# EAGLE board ThrusterShieldV1.1 (EAGLE 6.6.0)
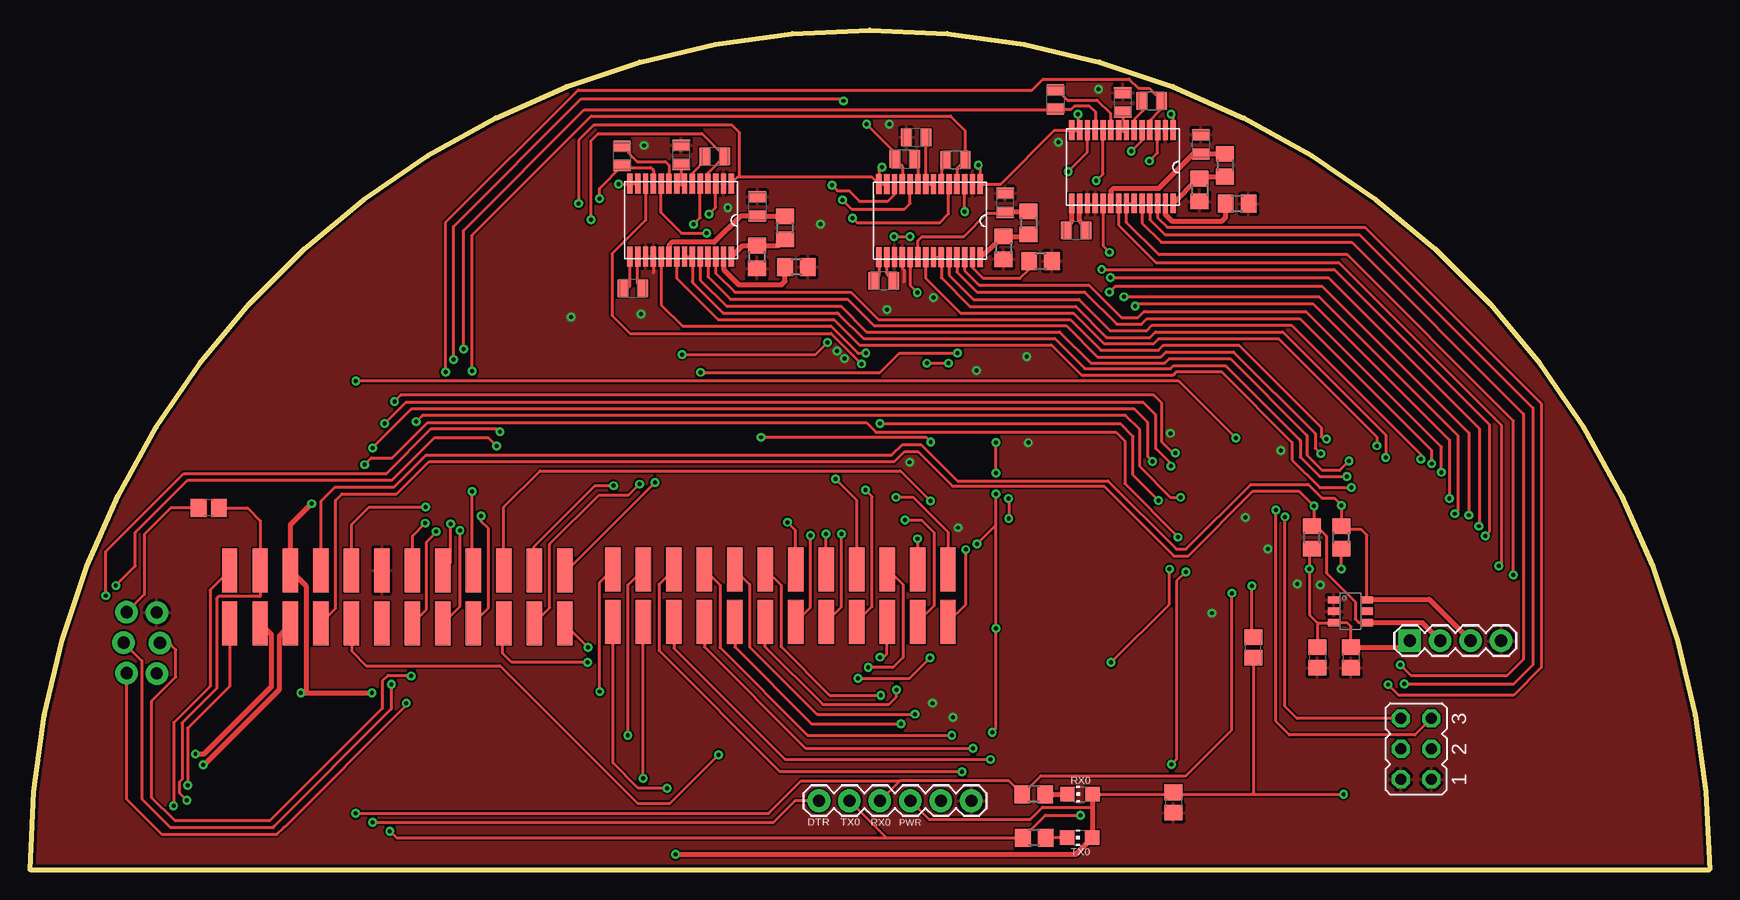
[diagram p5: board, top side]
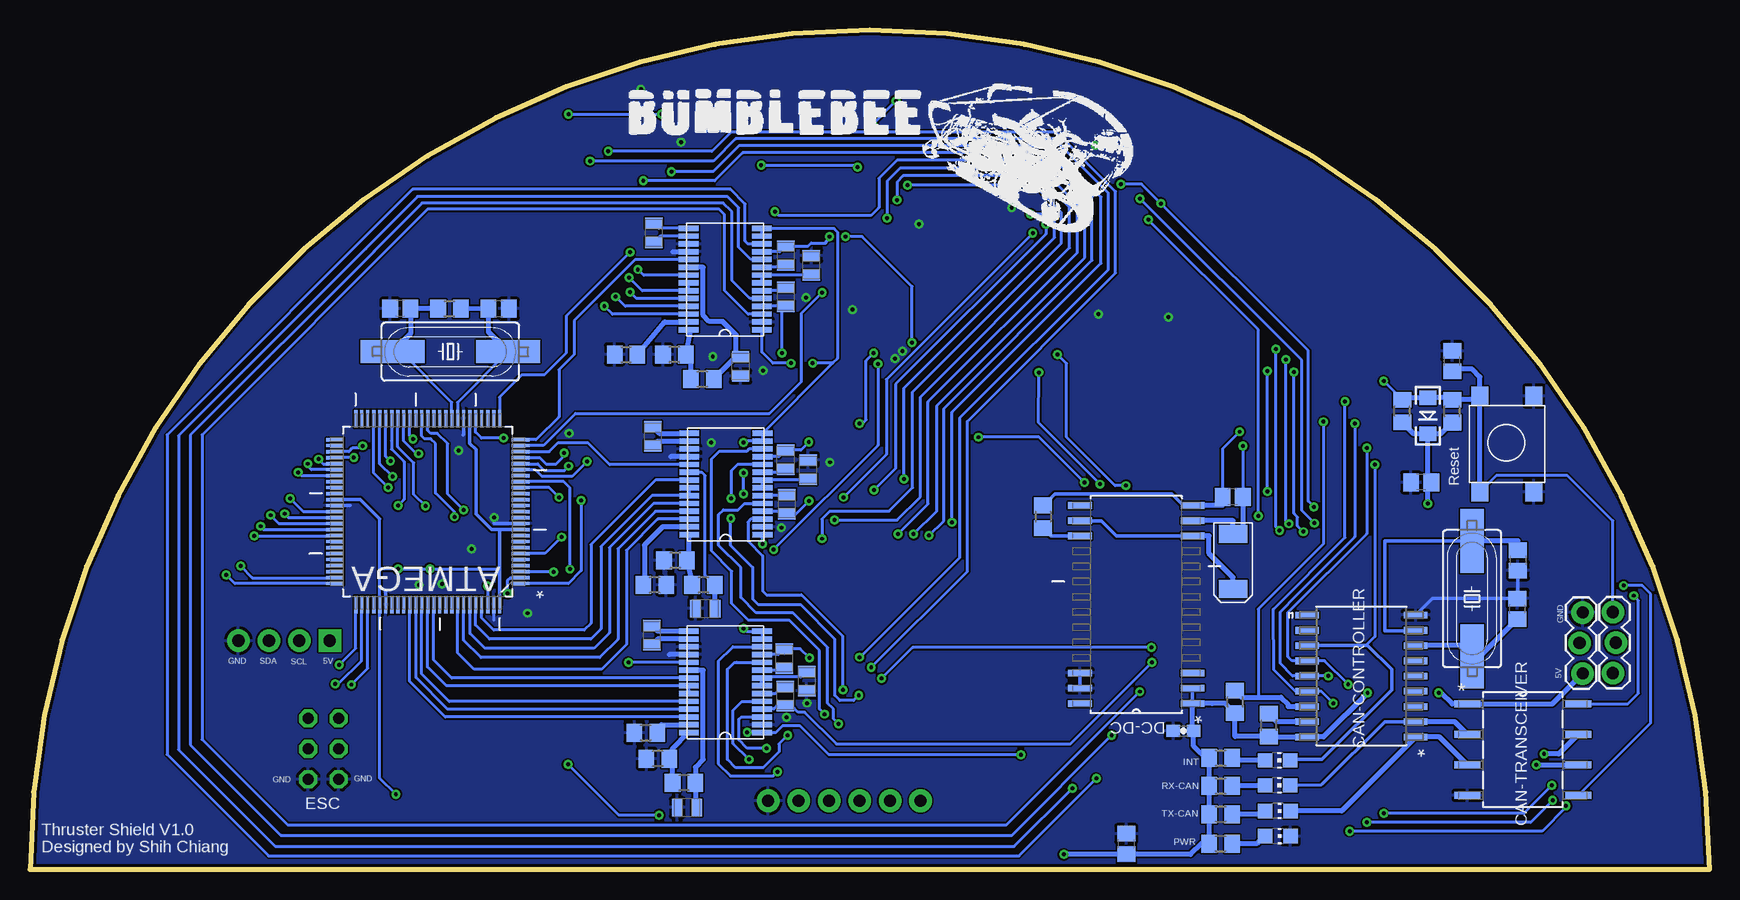
[diagram p6: board, bottom side, seen from below]

Size 140 x 70 mm. Coordinates in mm from the lower left corner, seen from the top.
Outline: 0,0 arc-90 70,70 arc-90 140,0 0,0
Copper layers (1*16): Top 0.035mm / dielectric 1.5mm / Bottom 0.035mm
Design rules "DFRobot_Eagle_Rule_v0.4": minimum track width 6mil, minimum drill 12mil, track to track 6mil, track to pad 6mil, pad to pad 6mil, via to via 6mil, smd to smd 0mil, copper to edge 10mil, drill to drill 10mil, minimum pad ring 12mil, minimum via ring 8mil, stop-mask expansion 2mil, vias tented up to drill 25mil, thermal gap 10mil

## Footprints (pad centres in the part's own frame; a part is rotated, then mirrored left to right if it is on the bottom)
HC49UP = smd 5.334 x 1.93: 1 -4.826,0; 2 4.826,0
QFP50P1600X1600X120-100N = smd 1.473 x 0.279: 1 -7.747,5.994; 2 -7.747,5.512; 3 -7.747,5.004; 4 -7.747,4.496; 5 -7.747,3.988; 6 -7.747,3.505; 7 -7.747,2.997; 8 -7.747,2.489; 9 -7.747,2.007; 10 -7.747,1.499; 11 -7.747,0.991; 12 -7.747,0.508; 13 -7.747,0; 14 -7.747,-0.508; 15 -7.747,-0.991; 16 -7.747,-1.499; 17 -7.747,-2.007; 18 -7.747,-2.489; 19 -7.747,-2.997; 20 -7.747,-3.505; 21 -7.747,-3.988; 22 -7.747,-4.496; 23 -7.747,-5.004; 24 -7.747,-5.512; 25 -7.747,-5.994; 51 7.747,-5.994; 52 7.747,-5.512; 53 7.747,-5.004; 54 7.747,-4.496; 55 7.747,-3.988; 56 7.747,-3.505; 57 7.747,-2.997; 58 7.747,-2.489; 59 7.747,-2.007; 60 7.747,-1.499; 61 7.747,-0.991; 62 7.747,-0.508; 63 7.747,0; 64 7.747,0.508; 65 7.747,0.991; 66 7.747,1.499; 67 7.747,2.007; 68 7.747,2.489; 69 7.747,2.997; 70 7.747,3.505; 71 7.747,3.988; 72 7.747,4.496; 73 7.747,5.004; 74 7.747,5.512; 75 7.747,5.994 | smd 0.279 x 1.473: 26 -5.994,-7.747; 27 -5.512,-7.747; 28 -5.004,-7.747; 29 -4.496,-7.747; 30 -3.988,-7.747; 31 -3.505,-7.747; 32 -2.997,-7.747; 33 -2.489,-7.747; 34 -2.007,-7.747; 35 -1.499,-7.747; 36 -0.991,-7.747; 37 -0.508,-7.747; 38 0,-7.747; 39 0.508,-7.747; 40 0.991,-7.747; 41 1.499,-7.747; 42 2.007,-7.747; 43 2.489,-7.747; 44 2.997,-7.747; 45 3.505,-7.747; 46 3.988,-7.747; 47 4.496,-7.747; 48 5.004,-7.747; 49 5.512,-7.747; 50 5.994,-7.747; 76 5.994,7.747; 77 5.512,7.747; 78 5.004,7.747; 79 4.496,7.747; 80 3.988,7.747; 81 3.505,7.747; 82 2.997,7.747; 83 2.489,7.747; 84 2.007,7.747; 85 1.499,7.747; 86 0.991,7.747; 87 0.508,7.747; 88 0,7.747; 89 -0.508,7.747; 90 -0.991,7.747; 91 -1.499,7.747; 92 -2.007,7.747; 93 -2.489,7.747; 94 -2.997,7.747; 95 -3.505,7.747; 96 -3.988,7.747; 97 -4.496,7.747; 98 -5.004,7.747; 99 -5.512,7.747; 100 -5.994,7.747
CAPC2013X70N = smd 0.914 x 1.448: 1 -0.813,0; 2 0.813,0
C0805 = smd 1.3 x 1.5: 1 -0.85,0; 2 0.85,0
EIA6032 = smd 1.5 x 2.4: P$1 -2.3,0; P$2 2.3,0
0603-CAP = smd 1.1 x 1: 1 -0.85,0; 2 0.85,0
SOIC127P1030X265-18N = smd 1.981 x 0.559: 1 -4.521,5.08; 2 -4.521,3.81; 3 -4.521,2.54; 4 -4.521,1.27; 5 -4.521,0; 6 -4.521,-1.27; 7 -4.521,-2.54; 8 -4.521,-3.81; 9 -4.521,-5.08; 10 4.521,-5.08; 11 4.521,-3.81; 12 4.521,-2.54; 13 4.521,-1.27; 14 4.521,0; 15 4.521,1.27; 16 4.521,2.54; 17 4.521,3.81; 18 4.521,5.08
SOIC254P1040X485-8N = smd 2.159 x 0.61: 1 -4.623,3.81; 2 -4.623,1.27; 3 -4.623,-1.27; 4 -4.623,-3.81; 5 4.623,-3.81; 6 4.623,-1.27; 7 4.623,1.27; 8 4.623,3.81
SOIC127P1032X265-12NA = smd 1.981 x 0.559: 1 -4.699,8.255; 2 -4.699,6.985; 3 -4.699,5.715; 12 -4.699,-5.715; 13 -4.699,-6.985; 14 -4.699,-8.255; 15 4.699,-8.255; 16 4.699,-6.985; 17 4.699,-5.715; 26 4.699,5.715; 27 4.699,6.985; 28 4.699,8.255
CHIP-LED0805 = smd 1.2 x 1.2: A 0,-1.05; C 0,1.05
1X03_LOCK = drill 1.016 pad 1.88: 1 0,0.127; 2 2.54,-0.127; 3 5.08,0.127
JP3Q = drill 0.914 octagon: 1 -2.54,-1.27; 2 -2.54,1.27; 3 0,-1.27; 4 0,1.27; 5 2.54,-1.27; 6 2.54,1.27
1X06 = drill 1.016 pad 1.88: CTS 10.16,0; DTR 0,0; GND 12.7,0; RXI 2.54,0; TXO 5.08,0; VCC 7.62,0
1X04 = drill 1.016 pad 1.88 square: 1 0,0 | drill 1.016 pad 1.88: 2 2.54,0; 3 5.08,0; 4 7.62,0
R0805 = smd 1.3 x 1.5: 1 -0.95,0; 2 0.95,0
LED-1206 = smd 1.2 x 1.4: A -1.5,0; C 1.5,0
15-91-0360 = smd 1.27 x 3.68: 1 -20.32,2.2; 2 -17.78,2.2; 3 -15.24,2.2; 4 -12.7,2.2; 5 -10.16,2.2; 6 -7.62,2.2; 7 -5.08,2.2; 8 -2.54,2.2; 9 0,2.2; 10 2.54,2.2; 11 5.08,2.2; 12 7.62,2.2; 13 -20.32,-2.2; 14 -17.78,-2.2; 15 -15.24,-2.2; 16 -12.7,-2.2; 17 -10.16,-2.2; 18 -7.62,-2.2; 19 -5.08,-2.2; 20 -2.54,-2.2; 21 0,-2.2; 22 2.54,-2.2; 23 5.08,-2.2; 24 7.62,-2.2
SOT23-6 = smd 0.6 x 1.05: 1 -0.95,-1.35; 2 0,-1.35; 3 0.95,-1.35; 4 0.95,1.35; 5 0,1.35; 6 -0.95,1.35
TSSOP-28 = smd 1.65 x 0.45: 1 -3.05,4.195; 2 -3.05,3.545; 3 -3.05,2.895; 4 -3.05,2.245; 5 -3.05,1.595; 6 -3.05,0.945; 7 -3.05,0.295; 8 -3.05,-0.355; 9 -3.05,-1.005; 10 -3.05,-1.655; 11 -3.05,-2.305; 12 -3.05,-2.955; 13 -3.05,-3.605; 14 -3.05,-4.255; 15 3.05,-4.255; 16 3.05,-3.605; 17 3.05,-2.955; 18 3.05,-2.305; 19 3.05,-1.655; 20 3.05,-1.005; 21 3.05,-0.355; 22 3.05,0.295; 23 3.05,0.945; 24 3.05,1.595; 25 3.05,2.245; 26 3.05,2.895; 27 3.05,3.545; 28 3.05,4.195
B3F2-1000 = smd 1.6 x 1.4: 1 8.8,0.7; 2 0.8,0.7; 3 8.8,5.2; 4 0.8,5.2

## Placement (x,y rotation side)
16MHZ  [HC49UP]  19.8,22.58 90 bottom
ATMEGA  ATMEGA2560-16AU  [QFP50P1600X1600X120-100N]  106.85,29.84 180 bottom
C1  470nF  [CAPC2013X70N]  87.22,53.3 180 top
C2  100nF  [CAPC2013X70N]  85.48,64.22 90 top
C3  100nF  [CAPC2013X70N]  93.49,64.07 180 top
C4  4.7uF  [CAPC2013X70N]  91.09,63.94 90 top
C5  100nF  [CAPC2013X70N]  97.61,60.47 270 top
C6  470nF  [CAPC2013X70N]  50.25,48.46 180 top
C7  100nF  [CAPC2013X70N]  49.35,59.48 90 top
C8  100nF  [CAPC2013X70N]  57.09,59.47 180 top
C9  4.7uF  [CAPC2013X70N]  54.29,59.57 90 top
C10  100nF  [CAPC2013X70N]  60.64,55.28 270 top
C11  470nF  [CAPC2013X70N]  71.17,49.09 180 top
C12  100nF  [CAPC2013X70N]  72.91,59.24 0 top
C13  100nF  [CAPC2013X70N]  77.15,59.17 180 top
C14  4.7uF  [CAPC2013X70N]  73.86,61.04 180 top
C15  100nF  [CAPC2013X70N]  81.29,55.58 270 top
C16  470nF  [CAPC2013X70N]  88.01,53.08 90 bottom
C17  100nF  [CAPC2013X70N]  77.01,51.19 270 bottom
C18  100nF  [CAPC2013X70N]  76.99,47.76 90 bottom
C19  4.7uF  [CAPC2013X70N]  75.26,15.72 270 bottom
C20  100nF  [CAPC2013X70N]  80.77,41.94 90 bottom
C21  470nF  [CAPC2013X70N]  88.1,36.11 90 bottom
C22  100nF  [CAPC2013X70N]  77.02,34.16 270 bottom
C23  100nF  [CAPC2013X70N]  76.92,30.45 90 bottom
C24  4.7uF  [CAPC2013X70N]  75.14,33.34 90 bottom
C25  100nF  [CAPC2013X70N]  83.71,21.75 0 bottom
C26  470nF  [CAPC2013X70N]  88.16,19.55 90 bottom
C27  100nF  [CAPC2013X70N]  77.12,17.6 270 bottom
C28  100nF  [CAPC2013X70N]  77.04,14.47 90 bottom
C29  4.7uF  [CAPC2013X70N]  74.87,50.37 90 bottom
C30  100nF  [CAPC2013X70N]  85.23,5.17 0 bottom
C33  0.1uF  [C0805]  107.31,17.68 270 top
C34  10uF  [C0805]  110.11,17.68 270 top
C35  100nF  [C0805]  24.04,32.29 180 bottom
C36  100nF  [C0805]  95.32,5.59 270 top
C37  4.7nF  [C0805]  48.62,2.14 90 bottom
C40  22pF  [C0805]  109.13,46.76 180 bottom
C41  22pF  [C0805]  100.93,46.77 0 bottom
C42  0.1uF  [C0805]  14.92,30.16 180 top
C43  100nF  [C0805]  101.96,18.52 90 top
C44  22pF  [C0805]  21.45,42.39 90 bottom
C53  22pF  [C0805]  16,21.74 90 bottom
C54  22pF  [C0805]  15.97,25.78 270 bottom
C55  100nF  [C0805]  39.74,31.05 180 bottom
C56  1uF  [EIA6032]  39.71,25.68 90 bottom
C57  2.2uF  [0603-CAP]  43.85,11.55 0 bottom
CAN-CONTROLLER  MCP2515-E/SO  [SOIC127P1030X265-18N]  29.02,16.13 180 bottom
CAN-TRANSCEIVER  ISO1050DUBR  [SOIC254P1040X485-8N]  15.56,10 0 bottom
DC-DC  DCR010505U  [SOIC127P1032X265-12NA]  47.79,22.1 180 bottom
INT  [CHIP-LED0805]  36.01,9.1 270 bottom
JP1  [1X03_LOCK]  10.7,21.43 270 bottom
JP2  [1X03_LOCK]  7.93,16.38 90 bottom
JP3  [JP3Q]  115.54,10.06 90 top
JP4  [1X06]  65.77,5.73 0 top
JP5  [1X04]  115.01,19.08 0 top
PWR  [CHIP-LED0805]  35.98,2.78 270 bottom
Q2  [HC49UP]  104.95,43.18 0 bottom
R1  47k  [R0805]  100.63,55.5 180 top
R2  10k  [R0805]  106.86,27.69 90 top
R3  10k  [R0805]  109.3,27.69 90 top
R6  10k  [R0805]  99.62,58.72 270 top
R7  5k  [R0805]  97.49,56.65 270 top
R8  47k  [R0805]  63.89,50.22 180 top
R13  10k  [R0805]  62.92,53.5 270 top
R14  5k  [R0805]  60.59,51.07 270 top
R15  47k  [R0805]  84.24,50.71 180 top
R20  10k  [R0805]  83.25,53.91 270 top
R21  5k  [R0805]  81.14,51.83 270 top
R22  47k  [R0805]  90.31,42.94 0 bottom
R27  10k  [R0805]  83.96,40.88 180 bottom
R28  5k  [R0805]  86.28,42.93 180 bottom
R29  47k  [R0805]  87.92,23.73 180 bottom
R34  10k  [R0805]  83.86,23.73 180 bottom
R35  5k  [R0805]  86.2,25.77 180 bottom
R36  47k  [R0805]  88.67,11.41 0 bottom
R41  10k  [R0805]  85.48,7.22 180 bottom
R42  5k  [R0805]  87.67,9.24 180 bottom
R53  10k  [R0805]  25.62,38.23 90 bottom
R58  1M  [R0805]  105.03,46.77 0 bottom
R62  10k  [R0805]  21.45,38.22 90 bottom
R69  330  [R0805]  83.67,6.29 180 top
R70  330  [R0805]  83.72,2.66 180 top
R74  330  [R0805]  40.76,2.16 0 bottom
R75  330  [R0805]  40.76,4.62 0 bottom
R76  330  [R0805]  40.76,6.98 0 bottom
R77  330  [R0805]  40.76,9.32 0 bottom
R78  10k  [R0805]  36.73,12.04 90 bottom
R79  10k  [R0805]  55.54,29.41 270 bottom
R82  10k  [R0805]  39.55,13.98 90 bottom
RX0  [CHIP-LED0805]  87.53,6.29 90 top
RX-CAN  [CHIP-LED0805]  36.01,7.02 270 bottom
SWITCHING-CHIP-DIODE  [LED-1206]  23.49,37.84 270 bottom
TX0  [CHIP-LED0805]  87.5,2.66 90 top
TX-CAN  [CHIP-LED0805]  35.98,4.89 270 bottom
U$1  15-91-0360  [15-91-0360]  36.96,22.73 0 top
U$2  15-91-0360  [15-91-0360]  68.91,22.83 0 top
U$4  AD7414  [SOT23-6]  110.06,21.54 270 top
U$25  A3941KLPTR-T  [TSSOP-28]  91.1,58.59 270 top
U$26  A3941KLPTR-T  [TSSOP-28]  54.27,54.15 270 top
U$27  A3941KLPTR-T  [TSSOP-28]  75.02,54.11 270 top
U$28  A3941KLPTR-T  [TSSOP-28]  82.06,49.2 180 bottom
U$29  A3941KLPTR-T  [TSSOP-28]  81.99,32.12 180 bottom
U$30  A3941KLPTR-T  [TSSOP-28]  82.04,15.61 180 bottom
U$35  B3FS-1000  [B3F2-1000]  13.94,30.68 90 bottom

## Tracks (layer width: path | path; a pad name or v marks a point on that pad's centre or on a via)
+5V  (via drill 0.33)
  Top 0.254: RX0.A 95.4,6.29 102.06,6.29 | 102.06,6.29 109.48,6.29 v109.5,6.27 | JP4.VCC 74.93,4.19 83.39,4.19 84.4,5.21 88.55,5.21 | C43.1 101.96,6.39 102.06,6.29 | R2.1 106.66,26.53 v106.66,25.07 106.66,21.23 107.31,20.57 | v109.32,25.07 109.3,25.1 R3.1 | 107.31,20.57 108.69,20.57 U$4.3 108.75,20.55 109.83,20.55 110.11,20.27 C34.1 | 107.31,20.57 C33.1
  Top 0.406: v22.58,14.73 23.09,14.73 | 23.09,14.73 v28.5,14.73 | v53.82,1.27 87.17,1.27 TX0.A 88.55,5.21 88.55,6.26 RX0.A | 23.09,14.73 23.02,14.81 23.02,23.64 U$1.3 21.72,28.75 v23.47,30.51 | C36.1 95.4,6.44 95.4,6.29 | C34.1 114.46,18.53 JP5.1
  Bottom 0.254: ATMEGA.80 110.83,7.61 v109.5,6.27 | 100.85,25.07 v106.66,25.07 v109.32,25.07 110.74,25.07 arc-90 110.87,24.94 | 110.87,22.1 110.87,24.94 | 110.87,24.94 110.87,29.24
  Bottom 0.305: DC-DC.2 DC-DC.1 | ATMEGA.100 100.85,25.07 100.85,28.34 ATMEGA.10 101.51,28.34 102.82,29.65 102.82,35 103.34,35.52 ATMEGA.31 | ATMEGA.80 110.87,22.1 | ATMEGA.61 112.46,30.83 110.87,29.24
  Bottom 0.406: 41.48,13.85 40.36,13.85 R82.1 39.55,11.09 R78.1 36.69,11.05 CAN-CONTROLLER.18 32.18,11.05 v28.5,14.73 | 41.48,13.85 DC-DC.1 43.09,11.64 C57.2 43.01,10.29 41.83,9.12 R77.1 R76.1 R75.1 R74.1 42.37,2.16 43.25,1.27 49.3,1.27 | 41.45,13.87 41.48,13.85 | JP1.3 13.12,13.81 CAN-TRANSCEIVER.1 21.45,13.81 22.38,14.73 v22.58,14.73 | 49.3,1.27 v53.82,1.27 | R53.1 24.68,36.34 SWITCHING-CHIP-DIODE.C | SWITCHING-CHIP-DIODE.C 22.38,36.34 R62.1 | v23.47,30.51 23.47,32.41 | 23.47,32.41 23.47,36.32 SWITCHING-CHIP-DIODE.C | C37.1 49.3,1.29 49.3,1.27 | C35.1 23.47,32.41
BATT1  (via drill 0.33)
  Top 0.254: U$27.14 U$27.13 | U$25.14 85.41,61.64 80.93,57.16 U$27.1 79.21,58.56 v79.05,58.72 | U$25.1 95.29,62.8 v95.12,62.97 | v87.35,62.97 87.35,61.78 U$25.13 | v71.02,58.57 70.76,58.31 U$27.14 | U$27.14 70.16,57.76 59.02,57.76 U$26.1 59.16,57.89 59.16,61.42 58.52,62.05 46.99,62.05 45.73,60.8 v45.73,55.54 | 50.49,57.37 U$26.13 U$26.14 49.97,57.15 v49.07,57.15 | v32.97,30.23 28.27,30.23 26.8,28.75 U$1.5
  Top 0.406: U$25.13 U$25.14
  Bottom 0.254: v95.12,62.97 v87.35,62.97 | v79.05,58.72 71.17,58.72 v71.02,58.57 | v32.97,30.23 33.45,30.71 33.45,43.26 v45.73,55.54 47.35,57.15 v49.07,57.15
BATT2  (via drill 0.33)
  Top 0.254: v74.75,42.21 v76.56,42.21 | 80.52,28.73 v78.94,27.15 | 80.52,28.73 v80.52,20.12 80.52,11.73 v80.21,11.43 | U$1.17 26.8,18.24 28.04,16.99 39.17,16.99 50.65,5.51 53.34,5.51 v57.4,9.58 | 80.52,28.73 v80.52,31.32 | v80.52,33.07 v80.52,35.61
  Bottom 0.254: U$28.13 U$28.14 78.99,53.44 72.97,53.44 72.69,53.16 72.69,42.62 73.1,42.21 | U$30.13 U$30.14 80.27,19.87 v80.52,20.12 | 73.1,42.21 U$29.14 U$29.13 80.41,35.72 v80.52,35.61 | v76.56,42.21 78.08,42.21 78.99,43.13 78.99,45 U$28.1 | 73.1,42.21 v74.75,42.21 | v78.94,27.15 U$29.1 | v80.21,11.43 79,11.43 U$30.1 78.97,11.4 77.85,11.4 77.27,11.99 75.82,11.99 73.41,9.58 v57.4,9.58 | v80.52,31.32 v80.52,33.07
CANH  (via drill 0.33)
  Top 0.406: U$1.14 20.12,19.59 20.12,15.24 14.5,9.63 v13.79,9.63
  Bottom 0.406: CAN-TRANSCEIVER.7 12.58,9.63 v13.79,9.63
CANL  (via drill 0.33)
  Top 0.406: U$1.15 20.78,19.49 20.78,14.99 14.53,8.74 v14.43,8.74
  Bottom 0.406: v14.43,8.74 10.95,8.74 CAN-TRANSCEIVER.6
D8  (via drill 0.33)
  Top 0.254: v95.91,31.04 95.07,31.04 92.51,33.6 92.51,36.68 91.31,37.87 32.72,37.87 v32.18,37.34
  Bottom 0.254: v32.18,37.34 32.18,27.15 37.62,21.72 37.62,14.37 | v95.91,31.04 96.72,31.85 ATMEGA.17
  Bottom 0.406: R82.2 38.99,14.37 37.62,14.37 35.72,14.37 35.12,13.76 35.12,13.6 35.11,13.59 CAN-CONTROLLER.16
D45  (via drill 0.33)
  Top 0.254: JP3.6 105.61,12.6 104.62,13.59 v104.62,29.41
  Bottom 0.254: ATMEGA.39 107.36,36.16 107.11,35.92 106.6,35.92 106.2,35.51 106.2,31.39 104.62,29.82 v104.62,29.41
D46  (via drill 0.33)
  Top 0.254: JP3.5 115.44,11.23 104.98,11.23 103.86,12.34 v103.86,29.97
  Bottom 0.254: ATMEGA.38 106.85,36.62 106.6,36.37 106.05,36.37 105.18,35.51 105.18,31.29 v103.86,29.97
D50  (via drill 0.33)
  Top 0.254: v31.37,13.87 31.37,13.69 21.21,3.53 21.18,3.53 20.57,2.92 11,2.92 8.06,5.86 JP2.1 | v95.48,34.72 95.28,34.72 94.34,35.66 94.34,38.89 93.67,39.55 30.91,39.55 v30.38,39.01
  Bottom 0.254: v31.37,13.87 32.36,14.86 CAN-CONTROLLER.15 34.52,14.86 36.32,16.66 36.37,21.69 30.38,27.69 v30.38,39.01 | ATMEGA.22 97.51,34.34 96.98,33.81 96.16,33.81 95.48,34.49 v95.48,34.72
D51  (via drill 0.33)
  Top 0.254: v95.1,33.63 95.1,33.86 93.85,35.1 93.85,37.9 92.81,38.94 31.32,38.94 v29.57,37.19 | JP1.2 11.59,18.89 12.17,18.31 12.17,16.05 10.16,14.05 10.16,5.99 12.06,4.09 20.02,4.09 29.36,13.44 29.36,15.72 29.84,16.21 31.7,16.21 v31.77,16.13
  Bottom 0.254: v31.78,16.13 v31.77,16.13 CAN-CONTROLLER.14 34.75,16.13 35.76,17.17 35.76,21.49 34.39,22.91 29.57,27.74 v29.57,37.19 | ATMEGA.21 97.69,33.83 97.13,33.27 95.45,33.27 v95.1,33.63
D52  (via drill 0.33)
  Top 0.254: JP2.2 9.32,17.4 9.32,5.89 11.68,3.53 20.34,3.53 20.34,3.61 30.12,13.39 v30.12,15.44 | v93.57,34.01 93.17,34.42 93.17,37.29 92.08,38.38 31.77,38.38 28.57,35.18 v28.57,35.15
  Bottom 0.254: v30.12,15.44 32.08,17.4 CAN-CONTROLLER.13 34.8,17.4 35.13,17.73 35.13,21.44 28.57,27.99 v28.57,35.15 | ATMEGA.20 97.89,33.35 97.33,32.79 94.79,32.79 v93.57,34.01
DTR  (via drill 0.33)
  Top 0.254: C42.1 18.13,30.16 19.2,29.08 19.2,24.96 U$1.2 19.18,22.76 15.72,22.76 15.54,22.58 15.54,15.09 12.68,12.22 12.68,7.52 12.45,7.29 12.45,6.4 v13.08,5.77 | JP4.DTR 63.77,5.73 61.98,3.94 v28.55,3.94
  Bottom 0.254: v13.08,5.77 14.91,3.94 v28.55,3.94
FF1A  (via drill 0.33)
  Top 0.254: U$25.25 93.34,54.21 94.61,52.93 110.82,52.93 125.27,38.48 125.27,17.07 123.67,15.47 v114.55,15.47
  Bottom 0.254: ATMEGA.77 112.36,17.41 114.3,15.47 v114.55,15.47
FF1B  (via drill 0.33)
  Top 0.254: U$26.25 56.51,49.43 58.4,47.55 68.15,47.55 70.36,45.34 86.39,45.34 88.98,42.75 94.28,42.75 94.69,43.15 100.33,43.15 107.14,36.35 107.14,35.13 v107.59,34.67
  Bottom 0.254: v107.59,34.67 107.8,34.67 108.85,35.73 ATMEGA.42
FF1C  (via drill 0.33)
  Top 0.254: U$27.25 77.26,49.82 78.92,48.16 87.91,48.16 90.6,45.47 92.66,45.47 93.12,45.92 105.84,45.92 116.84,34.93 v116.84,33.83
  Bottom 0.254: ATMEGA.56 116.56,33.35 116.84,33.63 v116.84,33.83
FF1D  (via drill 0.33)
  Top 0.254: v91.19,47.75 107.44,47.75 119.02,36.17 119.02,29.92 v118.77,29.67
  Bottom 0.254: U$28.25 90.39,46.96 v91.19,47.75 | v118.77,29.67 118.44,29.34 ATMEGA.64
FF1E
  Bottom 0.254: U$29.25 87.86,29.87 90.98,26.75 90.98,19.2 92.51,17.68 102.41,17.68 103.85,19.12 ATMEGA.94
FF1F
  Bottom 0.254: U$30.25 105.19,13.37 107.82,16 107.82,22.08 ATMEGA.86
FF2A  (via drill 0.33)
  Top 0.254: U$25.26 93.99,54.34 94.79,53.54 111.28,53.54 125.98,38.84 125.98,16.84 123.67,14.53 114.1,14.53 v113.21,15.42
  Bottom 0.254: ATMEGA.78 111.84,22.08 111.84,16.79 v113.21,15.42
FF2B  (via drill 0.33)
  Top 0.254: U$26.26 57.16,49.72 58.75,48.13 68.45,48.13 70.74,45.85 86.72,45.85 89.26,43.31 94.08,43.31 94.49,43.71 100.79,43.71 107.64,36.86 107.64,36.07 107.82,35.89 v108.08,35.89
  Bottom 0.254: ATMEGA.41 108.34,36.16 v108.08,35.89
FF2C  (via drill 0.33)
  Top 0.254: U$27.26 77.91,49.95 79.12,48.74 88.27,48.74 90.98,46.02 92.35,46.02 92.86,46.53 106.35,46.53 117.65,35.23 v117.65,33.12
  Bottom 0.254: ATMEGA.57 117.37,32.84 v117.65,33.12
FF2D  (via drill 0.33)
  Top 0.254: v92.13,46.99 92.3,47.17 106.93,47.17 118.31,35.81 v118.31,30.94
  Bottom 0.254: U$28.26 91.44,46.31 v92.13,46.99 | ATMEGA.63 117.22,29.84 v118.31,30.94
FF2E
  Bottom 0.254: U$29.26 87.67,29.22 90.27,26.62 90.27,18.77 92.35,16.69 102.98,16.69 104.36,18.07 104.36,18.71 ATMEGA.93
FF2F
  Bottom 0.254: U$30.26 105.38,12.72 108.36,15.7 ATMEGA.85
GHA1  (via drill 0.33)
  Top 0.254: U$2.19 65.05,21.85 v65.05,27.86 | U$25.10 89.44,58 v88.88,57.43
  Bottom 0.254: v88.88,57.43 82.93,57.43 80.59,59.77 55.14,59.77 51.46,56.08 51.46,50.8 63.83,38.43 63.83,29.08 v65.05,27.86
GHA2  (via drill 0.33)
  Top 0.254: U$2.12 76.56,25.06 76.56,28.12 73.64,31.04 v72.19,31.04 | U$26.10 52.61,54.75 54.3,53.06 v56.41,53.06
  Bottom 0.254: v56.41,53.06 68.61,40.87 68.61,34.62 v72.19,31.04
GHA3  (via drill 0.33)
  Top 0.254: v67.72,55.83 68.48,55.07 72.9,55.07 73.36,55.53 U$27.10 | v72.92,29.13 74.32,29.13 75.34,28.12 75.34,21.98 U$2.23
  Bottom 0.254: v72.92,29.13 67.72,29.13 65.79,31.06 65.79,39.4 53.34,51.84 53.34,55.22 55.96,57.84 67.21,57.84 67.72,57.33 v67.72,55.83
GHA4  (via drill 0.33)
  Top 0.254: v53.11,6.78 50.7,6.78 48.59,8.89 U$2.13
  Bottom 0.254: U$28.10 79.89,50.86 80.92,51.89 80.92,55.17 81.86,56.11 107.7,56.11 112.01,51.79 112.01,51.77 127.61,36.17 127.61,9.98 119.56,1.93 57.96,1.93 v53.11,6.78
GHA5  (via drill 0.33)
  Top 0.254: U$2.6 62.59,23.74 62.59,18.59 66.65,14.53 v70.92,14.53 | v81.56,30.94 81.58,30.91 v81.58,29.26
  Bottom 0.254: U$29.10 81.04,33.77 81.56,33.25 v81.56,30.94 | v70.92,14.53 71.35,14.1 72.49,14.1 72.9,14.5 72.9,19.2 75.77,22.1 79.3,22.1 79.76,22.56 79.76,25.2 81.58,27.03 v81.58,29.26 81.56,29.29
GHA6  (via drill 0.33)
  Top 0.254: U$2.4 57.51,23.74 57.51,18.52 64.82,11.2 v76.83,11.2
  Bottom 0.254: v76.83,11.2 77.57,10.46 77.57,9.8 78.89,8.48 81.18,8.48 81.86,9.17 81.86,16.69 81.28,17.27 81.1,17.27 | 81.1,17.27 | 81.1,17.27 U$30.10
GHB1  (via drill 0.33)
  Top 0.254: U$2.10 71.48,25.06 72.77,23.76 72.77,17.68 71.93,16.84 v69.88,16.84 | v91.8,59.89 92.69,60.79 U$25.5
  Bottom 0.254: v91.8,59.89 83.16,59.89 81.56,61.49 54.46,61.49 49.51,56.54 49.51,49.73 61.87,37.36 61.87,24.84 v69.88,16.84
GHB2  (via drill 0.33)
  Top 0.254: U$2.21 70.21,21.93 70.21,31.09 v69.65,31.65 | v55.32,53.8 55.86,54.34 U$26.5
  Bottom 0.254: v55.32,53.8 55.32,52.98 67.84,40.46 67.84,33.45 v69.65,31.65
GHB3  (via drill 0.33)
  Top 0.254: U$2.20 67.64,21.9 v67.64,27.97 | U$27.5 76.58,57.13 76.58,54.69 75.79,53.9 68.96,53.9 v68.56,54.31
  Bottom 0.254: v67.64,27.97 65.13,30.48 65.13,39.01 52.7,51.44 52.7,55.42 55.78,58.5 67.46,58.5 68.56,57.4 v68.56,54.31
GHB4  (via drill 0.33)
  Top 0.254: U$2.2 49.84,23.74 v49.84,11.18
  Bottom 0.254: U$28.5 79.97,47.61 81.48,49.12 81.48,54.84 82.22,55.58 107.31,55.58 111.33,51.56 111.33,51.54 126.64,36.22 126.64,10.41 119.1,2.87 58.14,2.87 v49.84,11.18
GHB5  (via drill 0.33)
  Top 0.254: U$2.17 58.75,18.54 65.15,12.14 v72.59,12.14
  Bottom 0.254: 78.96,30.51 U$29.5 80.45,30.52 80.97,30 82.19,30 82.6,29.59 82.6,27.03 80.75,25.17 80.75,22.68 79.48,21.41 76.4,21.41 73.51,18.52 73.51,13.87 73.03,13.39 73.03,12.57 v72.59,12.14
GHB6  (via drill 0.33)
  Top 0.254: U$2.15 53.67,18.44 62.94,9.17 v80.06,9.17
  Bottom 0.254: v80.06,9.17 81.38,10.49 81.38,13.28 80.65,14.02 U$30.5
GLA1  (via drill 0.33)
  Top 0.254: U$25.12 88.14,59.8 v86.54,58.19 | U$2.7 63.83,28.27 v63.14,28.96
  Bottom 0.254: v63.14,28.96 63.14,38.13 50.72,50.55 50.72,56.08 54.99,60.35 80.9,60.35 83.06,58.19 v86.54,58.19
GLA2  (via drill 0.33)
  Top 0.254: U$2.24 78,22.11 v78,26.67 | U$26.12 51.31,54.13 48.51,51.33 48.51,46.2 50.01,44.7 66.78,44.7 v69.32,42.16 69.06,42.16
  Bottom 0.254: v69.32,42.16 69.32,35.36 v78,26.67
GLA3  (via drill 0.33)
  Top 0.254: v66.85,57.05 67.31,56.59 68.28,56.59 69.14,55.73 71.5,55.73 72.06,56.29 U$27.12 | 74.02,25.06 U$2.11 v73.99,27.58
  Bottom 0.254: v66.85,57.05 56.29,57.05 54.03,54.79 54.03,52.22 66.42,39.83 66.42,31.85 68.38,29.9 73.3,29.9 73.99,29.21 v73.99,27.58
GLA4  (via drill 0.33)
  Top 0.254: v51.1,7.59 51.1,20.61 U$2.14
  Bottom 0.254: U$28.12 80.15,52.16 80.39,52.4 80.39,55.5 81.61,56.72 108.1,56.72 128.57,36.25 128.57,9.6 120.12,1.14 57.56,1.14 v51.1,7.59
GLA5  (via drill 0.33)
  Top 0.254: U$2.5 59.99,23.79 59.99,18.54 65.61,12.93 65.63,12.95 v73.76,12.95
  Bottom 0.254: v73.76,12.95 74.19,13.39 74.19,18.26 76.71,20.78 80.11,20.78 81.51,22.17 81.51,24.87 83.19,26.54 83.19,34.24 82.55,34.87 80.24,34.87 80.04,35.07 U$29.12
GLA6  (via drill 0.33)
  Top 0.254: U$2.3 52.43,23.79 52.43,18.26 62.53,8.15 v77.7,8.15
  Bottom 0.254: U$30.12 81.41,18.57 82.63,17.35 82.63,8.81 81.61,7.8 78.05,7.8 v77.7,8.15
GLB1  (via drill 0.33)
  Top 0.254: U$2.22 71.4,20.58 71.4,17.96 71.14,17.7 v70.84,17.7 | U$25.3 93.99,59.75 v93.32,59.08
  Bottom 0.254: v93.32,59.08 83.03,59.08 81.18,60.93 54.63,60.93 50.11,56.41 50.11,50.04 62.48,37.67 62.48,26.04 70.81,17.7 v70.84,17.7
GLB2  (via drill 0.33)
  Top 0.254: U$2.9 68.94,25.06 68.94,30.78 v67.16,32.56 | v56.59,54.64 57.16,55.21 U$26.3
  Bottom 0.254: v67.16,32.56 67.16,40.13 54.59,52.71 54.59,54.23 54.99,54.64 v56.59,54.64
GLB3  (via drill 0.33)
  Top 0.254: U$2.8 66.34,25.06 v66.34,27.97 | v77.91,54.85 U$27.3
  Bottom 0.254: v66.34,27.97 64.41,29.9 64.41,38.68 52.07,51.03 52.07,55.78 55.42,59.13 67.74,59.13 69.24,57.63 69.24,55.19 69.9,54.53 77.6,54.53 v77.91,54.85
GLB4  (via drill 0.33)
  Top 0.254: v47.5,14.83 47.5,23.94 U$2.1
  Bottom 0.254: U$28.3 80.14,46.31 82.12,48.29 82.12,54.61 82.55,55.04 106.86,55.04 125.65,36.25 125.65,10.85 118.52,3.71 58.62,3.71 v47.5,14.83
GLB5  (via drill 0.33)
  Top 0.254: U$2.18 61.29,18.57 66.09,13.77 71.6,13.77 72.24,14.4 v72.24,14.99
  Bottom 0.254: U$29.3 79.9,29.22 80.16,28.96 80.16,27.41 78.92,26.16 78.92,23.22 78.61,22.91 75.69,22.91 72.24,19.46 v72.24,14.99
GLB6  (via drill 0.33)
  Top 0.254: U$2.16 56.21,18.54 64.64,10.11 v78.61,10.11
  Bottom 0.254: v78.61,10.11 80.21,10.11 80.9,10.8 80.9,12.52 80.7,12.73 U$30.3
GND  (via drill 0.33)
  Top 0.254: U$27.18 72.71,50.15 72.87,49.99 72.87,49.02 72.85,49 | U$26.18 51.96,49.75 51.94,49.73
  Bottom 0.254: ATMEGA.32 | ATMEGA.99 101.35,22.08 101.35,20.8
  Bottom 0.305: DC-DC.26 DC-DC.27 | CAN-CONTROLLER.9 23.12,22.59 C53.2 15.97,22.62 C54.2 | ATMEGA.11 99.11,28.84 101.32,28.84 v101.32,29.35 | ATMEGA.81 110.36,23.23 | ATMEGA.62 113.31,30.35 | ATMEGA.32 103.85,36.27 103.88,36.24
  Bottom 0.406: U$28.18 85.12,51.49 86.41,51.49 | U$29.18 86.59,34.42 | U$30.18 86.69,17.92
  other vias: 103.2,26.74 104.26,34.94 107.56,23.74 51.18,60.38 71.63,62.15 89.08,65.05 78.89,41.61 83.08,42.77 73.33,33.96 75.23,13.87 76.94,12.67 83.21,35.59 77.37,28.5 50.93,46.3 71.45,46.69 85.72,60.66 75.31,47.7 98.52,21.38 105.66,23.81 95.07,36.37 65.89,53.82 58.17,55.19 45.11,46.05 67.26,43.23 67.89,42.6
  pour Bottom: 0,0 140,0 140,70 0,70
  pour Top: 0,0 140,0 140,70 0,70
GNDBUS  (via drill 0.33)
  Top 0.254: v7.16,23.67 8.79,25.3 8.79,28.09 13.16,32.46 30.18,32.46 33.73,36.02 38.18,36.02 v38.89,35.31
  Bottom 0.254: CAN-TRANSCEIVER.5 4.9,12.23 4.9,22.96 5.61,23.67 v7.16,23.67 | 38.58,31.37 C55.1 v38.89,35.31
  Bottom 0.406: C55.1 38.9,27.98 C56.P$2 39.72,29.09 DC-DC.13
INT  (via drill 0.33)
  Top 0.254: v27.89,33.76 28.45,34.32 30.2,34.32 33.15,37.26 69.72,37.26 70.51,36.47 90.5,36.47 91.26,35.71 91.26,32.18 v95.68,27.71
  Bottom 0.254: CAN-CONTROLLER.12 28.65,18.67 27.89,19.43 v27.89,33.76 | INT.C 34.88,9.19 | ATMEGA.6 99.07,26.37 97.08,26.37 v95.68,27.71
  Bottom 0.305: CAN-CONTROLLER.12 33.51,18.7 28.5,18.7 26.49,16.69 26.49,14.99 32.3,9.19 34.88,9.19
N$1
  Top 0.406: U$25.27 94.64,54.61 95.17,54.08 99.36,54.08 99.67,54.38 99.67,55.49 R1.2
N$3
  Top 0.406: C1.1 87.49,54.15 U$25.16
N$4
  Top 0.406: C1.2 86.84,54.06 U$25.15
N$5
  Top 0.254: C3.2 92.72,63.21 92.08,62.56 92.08,61.67 U$25.6
N$6
  Top 0.254: C2.2 85.59,65.03 86.46,64.16 88.95,64.16 90.07,63.04 90.07,61.66 U$25.9
N$10
  Top 0.254: C4.1 91.14,61.89 U$25.7
  Top 0.406: U$25.8 U$25.7
N$11
  Top 0.406: U$25.20 90.1,56.59 90.29,56.78 94.06,56.78 96.94,59.66 C5.2 R6.1
N$12
  Top 0.406: R6.2 97.66,57.77 R7.1 97.36,57.6 U$25.28
N$13
  Top 0.406: U$26.27 57.81,50.03 59.08,48.77 62.66,48.77 62.94,49.05 R8.2
N$14
  Top 0.254: C8.2 56.28,59.13 55.21,58.06 U$26.6
N$15
  Top 0.254: C7.2 50.62,59.03 52.96,59.03 53.26,58.72 U$26.9
N$16
  Top 0.254: C9.1 54.29,57.57 U$26.8
  Top 0.406: U$26.8 U$26.7
N$21
  Top 0.254: C6.1 50.66,48.86 U$26.16
N$22
  Top 0.254: 49.59,48.22 50.01,48.64 U$26.15
  Top 0.406: 49.59,48.22 C6.2
N$23
  Top 0.406: U$26.20 53.27,51.11 53.27,52.07 53.49,52.29 57.04,52.29 59.22,54.47 C10.2 62.9,54.47 R13.1
N$24
  Top 0.406: U$26.28 59.38,52.02 R14.1 62.39,52.02 R13.2
N$25
  Top 0.254: U$27.27 78.56,50.19 79.45,49.3 82.53,49.3 83.26,50.04 83.26,50.69
  Top 0.406: 83.26,50.69 R15.2
N$26
  Top 0.254: C13.2 75.96,58.8 U$27.6
N$27
  Top 0.254: C12.2 74.01,58.95 U$27.9
N$28
  Top 0.254: C14.1 74.66,61.03 U$27.8 U$27.7
N$33
  Top 0.254: U$27.16 71.41,49.66 C11.1
N$34
  Top 0.254: U$27.15 70.76,49.5 C11.2
N$35
  Top 0.254: C15.2 81.23,54.71 79.78,54.71 77.85,52.78 74.37,52.78 74.01,52.42 U$27.20
  Top 0.406: C15.2 81.21,54.87 R20.1
N$36
  Top 0.406: U$27.28 79.23,51.04 R21.1 83.06,52.78 R20.2
N$36A
  Bottom 0.406: CAN-CONTROLLER.17 36.06,12.32 R78.2
N$37
  Bottom 0.406: R22.2 87.09,45.66 U$28.27
N$38
  Bottom 0.254: C18.2 77.3,48.26 U$28.6
N$39
  Bottom 0.254: C17.2 77.17,50.21 U$28.9
N$40
  Bottom 0.254: C29.1 75.47,49.56 U$28.8 U$28.7
N$45
  Bottom 0.254: U$28.16 87.46,52.81 C16.1
N$46
  Bottom 0.254: U$28.15 87.58,53.46 C16.2
N$47
  Bottom 0.406: C20.2 81.14,42.75 | 81.14,42.75 R27.1 | 81.14,42.75 81.14,44.56 82.27,45.7 83.38,45.7 83.89,46.21 83.89,50.21 U$28.20
N$48
  Bottom 0.406: R27.2 84.91,43.02 R28.1 84.94,44.84 U$28.28
N$49
  Bottom 0.406: U$29.27 87.25,28.57 88.77,27.05 88.77,23.83 R29.2
N$50
  Bottom 0.254: C23.2 77.01,31.17 U$29.6
N$51
  Bottom 0.254: C22.2 77.25,33.12 U$29.9
N$52
  Bottom 0.254: C24.1 75.19,32.47 U$29.8 U$29.7
N$57
  Bottom 0.406: C21.1 87.67,35.72 U$29.16
N$58
  Bottom 0.406: C21.2 87.54,36.37 U$29.15
N$59
  Bottom 0.254: R34.1 83.72,24.54 83.72,32.84 84,33.12 U$29.20
  Bottom 0.406: C25.2 82.89,23.71 R34.1
N$60
  Bottom 0.406: R34.2 84.73,23.81 R35.1 85.04,26.33 U$29.28
N$61
  Bottom 0.406: R36.2 87.39,12.07 U$30.27
N$62
  Bottom 0.254: C28.2 77.25,15.28 77.88,14.66 78.97,14.66 U$30.6
N$63
  Bottom 0.254: C27.2 77.3,16.62 U$30.9
N$64
  Bottom 0.254: C19.1 75.74,16.05 78.9,16.05 U$30.8
  Bottom 0.406: U$30.8 U$30.7
N$69
  Bottom 0.406: U$30.16 87.67,19.22 C26.1
N$70
  Bottom 0.406: U$30.15 87.66,19.87 C26.2
N$71
  Bottom 0.406: 84.4,7.36 R41.1 | U$30.20 83.89,16.62 83.89,9.17 84.53,8.53 R41.1 | R41.1 | R41.1 84.53,5.28 C30.2
N$72
  Bottom 0.406: R41.2 86.43,9.3 R42.1 86.42,10.08 U$30.28
N$86  (via drill 0.33)
  Top 0.254: C43.2 101.85,19.48 v101.85,23.65
  Bottom 0.254: v101.85,23.65 v101.84,23.64 ATMEGA.98
N$92
  Top 0.406: R69.1 RX0.C
N$93
  Top 0.254: TX0.C R70.1
N$108
  Bottom 0.406: PWR.A 37.07,2.82 37.73,2.16 R74.2
N$109
  Bottom 0.406: TX-CAN.A 37.07,4.93 37.37,4.62 R75.2
N$110
  Bottom 0.406: RX-CAN.A 37.12,6.98 R76.2
N$111
  Bottom 0.406: INT.A 39.6,9.12 R77.2
N$112
  Bottom 0.305: DC-DC.17 54.9,27.82 R79.2
OSC1
  Bottom 0.305: 16MHZ.2 27.05,27.41 27.05,19.89 24.5,19.89 CAN-CONTROLLER.8
  Bottom 0.406: C54.1 15.97,27.41 16MHZ.2
OSC2
  Bottom 0.406: C53.1 19.13,17.76 16MHZ.1 20.71,18.67 CAN-CONTROLLER.7
PHASE1  (via drill 0.33)
  Top 0.254: U$25.19 89.44,52.01 v89.99,51.46
  Bottom 0.254: ATMEGA.26 100.85,38.15 100.86,38.16 100.86,39.4 99.01,41.25 97.13,41.25 95.3,43.08 95.3,46.15 v89.99,51.46
PHASE2  (via drill 0.33)
  Top 0.254: U$26.19 52.61,47.08 54.38,45.31 66.75,45.31 69.01,43.05 v69.67,43.05 | v94.06,30.78 91.95,32.89 91.95,36.12 90.88,37.19 v70.87,37.19
  Bottom 0.254: v94.06,30.78 94.06,24.92 95.12,23.85 ATMEGA.1 | v69.67,43.05 70.31,42.42 70.31,37.49 70.61,37.19 v70.87,37.19
PHASE3  (via drill 0.33)
  Top 0.254: U$27.19 73.36,48.71 v73.97,48.11
  Top 0.406: U$27.19
  Bottom 0.254: v73.97,48.11 75.72,46.36 75.72,40.67 78.36,38.02 94.54,38.02 97.21,35.36 ATMEGA.24
PHASE4
  Bottom 0.254: ATMEGA.25 97.81,35.84 95.91,37.74 95.91,41.68 94.64,42.95 94.64,45.77 89.55,50.86 U$28.19
PHASE5
  Bottom 0.254: U$29.19 91.68,33.77 93.51,35.6 95.97,35.6 96.72,34.85 ATMEGA.23
PHASE6  (via drill 0.33)
  Top 0.254: v90.11,17.27 94.97,22.12 94.97,25.02 v95,25.04
  Bottom 0.254: U$30.19 v90.11,17.27 | ATMEGA.18 95.5,32.33 95,31.83 v95,25.04
PWM1  (via drill 0.33)
  Top 0.254: U$25.23 U$25.22 91.42,55.51 91.42,53.95 94.11,51.26 109.8,51.26 123.65,37.41 v123.65,24.56
  Bottom 0.254: ATMEGA.75 122.93,23.85 v123.65,24.56
PWM2  (via drill 0.33)
  Top 0.254: U$26.22 U$26.23 55.21,49.08 arc45 55.29,48.9 57.78,46.41 67.23,46.41 arc-45 67.41,46.33 69.47,44.27 85.42,44.27 87.94,41.76 95.07,41.76 95.33,42.01 99.56,42.01 arc-45 99.74,41.94 105.82,35.86 arc-45 105.89,35.68 105.89,34.39 107.44,32.84 arc45 107.62,32.77 v109.78,32.77
  Bottom 0.254: v109.78,32.77 110.83,33.82 ATMEGA.46
PWM3  (via drill 0.33)
  Top 0.254: U$27.22 U$27.23 75.96,49.34 78.36,46.94 87.17,46.94 89.74,44.37 93.37,44.37 93.83,44.83 104.42,44.83 113,36.25 v113,34.34
  Bottom 0.254: v113,34.34 v113.01,34.34 ATMEGA.54
PWM4  (via drill 0.33)
  Top 0.254: v90.07,49.35 108.23,49.35 120.8,36.78 120.8,28.6 v120.78,28.63
  Bottom 0.254: U$28.22 U$28.23 88.98,48.26 v90.07,49.35 | ATMEGA.66 120.55,28.34 120.78,28.58 v120.78,28.63
PWM5
  Bottom 0.254: U$29.22 U$29.23 88.16,31.17 92.41,26.92 92.41,20.07 93.24,19.23 101.7,19.23 102.86,20.39 ATMEGA.96
PWM6
  Bottom 0.254: U$30.23 U$30.22 105.28,15.32 106.86,16.89 ATMEGA.88
RES  (via drill 0.33)
  Top 0.254: v100.51,35.97 95.76,40.72 v27.16,40.72 | C42.2 11.74,30.16 9.53,27.94 9.53,22.92 JP2.3
  Bottom 0.254: 102.84,37.6 ATMEGA.30 102.87,36.47 102.36,35.97 v100.51,35.97 | JP2.3 8.06,29.06 11.86,32.87 17.76,32.87 U$35.4 | v27.16,40.72 R53.2
  Bottom 0.406: U$35.4 U$35.3 | U$35.3 19.46,39.17 R62.2 21.62,39.34 SWITCHING-CHIP-DIODE.A 25.46,39.34 R53.2 | U$35.3 19.14,41.07 19.78,41.71 21.45,41.71 C44.1
RESET1  (via drill 0.33)
  Top 0.254: U$25.24 92.69,53.92 94.31,52.3 110.19,52.3 124.48,38 124.48,17.53 123.11,16.15 115.14,16.15 v114.22,17.07
  Bottom 0.254: v114.22,17.07 112.84,18.45 ATMEGA.76
RESET2  (via drill 0.33)
  Top 0.254: U$26.24 55.86,49.17 58.06,46.96 67.61,46.96 69.75,44.83 85.83,44.83 88.42,42.24 94.61,42.24 94.97,42.6 100.05,42.6 106.45,36.2 106.45,34.54 107.7,33.3 109.19,33.3 v109.96,34.06
  Bottom 0.254: v109.96,34.06 110.35,34.46 ATMEGA.45
RESET3  (via drill 0.33)
  Top 0.254: U$27.24 76.61,49.58 78.66,47.52 87.45,47.52 90.02,44.96 93.09,44.96 93.52,45.39 105.16,45.39 115.95,34.59 v115.95,34.21
  Bottom 0.254: v115.95,34.21 115.57,33.83 ATMEGA.55
RESET4  (via drill 0.33)
  Top 0.254: v89.97,48.13 90.47,48.64 107.7,48.64 119.94,36.4 v119.94,29.54
  Bottom 0.254: U$28.24 89.44,47.61 v89.97,48.13 | v119.94,29.54 119.25,28.85 ATMEGA.65
RESET5
  Bottom 0.254: U$29.24 88.02,30.52 91.69,26.85 91.69,19.74 92.99,18.44 102.08,18.44 103.33,19.69 103.33,22.08 ATMEGA.95
RESET6
  Bottom 0.254: U$30.24 105.05,14.02 107.37,16.33 107.37,22.08 ATMEGA.87
RX0  (via drill 0.33)
  Top 0.254: v100.18,23.04 100.18,11.63 96.37,7.82 84.25,7.82 R69.2 81.62,7.39 72.51,7.39 | U$1.13 16.64,15.29 13.13,11.79 v13.13,7.01 | 72.51,7.39 JP4.TXO | v27.15,4.67 61.57,4.67 64.29,7.39 72.51,7.39
  Bottom 0.254: v100.18,23.04 100.18,24.1 99.95,24.33 ATMEGA.2 | v13.13,7.01 15.47,4.67 v27.15,4.67
RX-CAN
  Bottom 0.254: 32.26,7.14 32.38,7.02 RX-CAN.C
  Bottom 0.305: CAN-CONTROLLER.2 27.08,12.32 32.26,7.14 | 34.94,7.04 RX-CAN.C
  Bottom 0.406: CAN-TRANSCEIVER.2 21.24,12.32 CAN-CONTROLLER.2
SA1  (via drill 0.33)
  Top 0.254: U$1.20 35.84,21.96 v35.84,28.27 | v36.14,43.38 36.14,53.29 46.2,63.35 85.42,63.35 C2.1 86.83,63.41 87.1,63.68 88.29,63.68 88.8,63.17 U$25.11
  Bottom 0.254: v35.84,28.27 36.14,28.58 v36.14,43.38
SA2  (via drill 0.33)
  Top 0.254: U$1.7 31.88,27.81 v32.94,28.88 | U$26.11 51.96,58.3 51.74,58.52 49.5,58.52 C7.1 47.47,56.79 v47.47,55.93
  Bottom 0.254: v47.47,55.93 33.98,42.47 33.98,29.95 v32.94,28.88
SA3  (via drill 0.33)
  Top 0.254: 72.45,58.89 C12.1 72.1,59.78 | 72.45,58.89 72.71,58.63 U$27.11 | U$1.8 35.05,25.57 v35.05,28.83 | v35.31,42.52 35.31,53.62 45.95,64.26 67.64,64.26 v67.82,64.08 | v69.75,62.15 72.45,59.45 72.45,58.89
  Bottom 0.254: v35.05,28.83 35.31,29.08 v35.31,42.52 | v67.82,64.08 v69.75,62.15
SA4  (via drill 0.33)
  Top 0.254: U$1.11 42.04,26.95 47.09,32 v48.64,32 | v54.36,42.95 65.48,42.95 v66.47,43.94 | v72.03,52.78 v73.36,52.78
  Bottom 0.254: U$28.11 77.5,51.51 C17.1 75.13,52 74.88,52.25 73.69,52.25 v73.36,52.78 | v54.36,42.95 53.59,42.19 53.59,36.04 49.55,32 v48.64,32 | v66.47,43.94 66.47,48.62 70.64,52.78 v72.03,52.78
SA5  (via drill 0.33)
  Top 0.254: U$1.12 44.77,24.93 v52.09,32.26 | v60.94,36.04 74.68,36.04 v75.08,35.64
  Bottom 0.254: U$29.11 77.57,34.42 C22.1 75.74,34.98 v75.08,35.64 | v52.09,32.26 55.88,36.04 v60.94,36.04
SA6  (via drill 0.33)
  Top 0.254: U$1.24 44.58,20.47 v46.53,18.52 | v69.01,15.93 73.3,15.93 v75.03,17.65
  Bottom 0.254: C27.1 77.62,17.92 U$30.11 | v46.53,18.52 66.42,18.52 v69.01,15.93 | 77.12,18.02 C27.1 | v75.03,17.65 75.79,18.42 C27.1
SB1  (via drill 0.33)
  Top 0.254: U$1.19 33.05,21.7 33.05,27.31 33.86,28.12 v33.86,28.17 | v34.65,41.48 34.65,53.98 45.7,65 83.54,65 84.45,65.91 91.62,65.91 92.41,65.13 93.3,65.13 C3.1 94.16,63.88 94.16,63.27 93.34,62.46 U$25.4
  Bottom 0.254: v33.86,28.17 34.34,28.65 34.34,29.39 34.65,29.69 v34.65,41.48
SB2  (via drill 0.33)
  Top 0.254: U$1.21 38.23,21.8 38.23,28.42 37.62,29.03 v37.62,29.49 | U$26.4 56.51,58.08 C8.1 56.01,61.37 47.37,61.37 46.76,60.76 v46.76,54.18
  Bottom 0.254: v37.62,29.49 37.62,45.01 46.76,54.15 v46.76,54.18
SB3  (via drill 0.33)
  Top 0.254: U$27.4 77.26,58.47 C13.1 77.95,61.6 76.73,62.81 46.79,62.81 36.85,52.88 v36.85,41.55 | U$1.9 36.85,25.03 v36.85,31.52
  Bottom 0.254: v36.85,31.52 v36.85,41.55
SB4  (via drill 0.33)
  Top 0.254: U$1.23 43.33,21.83 43.33,27.13 47.42,31.22 49.89,31.22 v50.8,32.13 | v55.91,41.45 70.87,41.45 72.47,43.05 v77.32,43.05
  Bottom 0.254: U$28.4 77,46.96 C18.1 77.32,46.62 v77.32,43.05 | v55.91,41.45 55.93,37.26 v50.8,32.13
SB5  (via drill 0.33)
  Top 0.254: U$1.10 39.5,30.23 42.52,33.25 72.54,33.25 v75.06,30.73
  Bottom 0.254: U$29.4 77.16,29.87 C23.1 76.16,29.63 v75.06,30.73
SB6  (via drill 0.33)
  Top 0.254: v46.48,17.27 40.16,17.27 39.4,18.03 39.4,20.43 U$1.22
  Bottom 0.254: v46.48,17.27 53.29,10.46 72.77,10.46 75.43,13.12 75.96,13.12 76.48,13.64 77.03,13.64 C28.1 77.74,13.65 78,13.39 78.97,13.39 U$30.4
SCL  (via drill 0.33)
  Top 0.254: U$1.16 25.48,21.75 25.48,30.78 26.01,31.32 30.58,31.32 33.27,34.01 72.06,34.01 72.9,34.85 74.02,34.85 76.89,31.98 89.51,31.98 95.35,26.14 96.55,26.14 101.96,31.55 105.79,31.55 v107.04,30.3 107.04,28.81 108.05,27.8 108.05,24.74 110.47,22.33 110.47,20.88 110.75,20.59 U$4.4
  Top 0.305: 107.04,28.81 R2.2
  Top 0.406: U$4.4 116.04,20.59 JP5.2
  Bottom 0.254: ATMEGA.43 109.34,35.24 108,33.91 108,31.27 v107.04,30.3
SDA  (via drill 0.33)
  Top 0.254: U$1.4 24.26,30.71 25.43,31.88 30.35,31.88 33.02,34.54 71.83,34.54 72.72,35.43 74.27,35.43 77.29,32.41 89.86,32.41 95.56,26.72 96.37,26.72 101.75,32.11 106.55,32.11 107.7,30.96 108.71,30.96 v109.32,30.35 109.32,28.66 R3.2 109.59,28.35 111,28.35 111.45,27.89 111.45,22.54 U$4.6
  Top 0.406: 111.45,22.54 116.63,22.54 JP5.3
  Bottom 0.254: 109.86,37.58 ATMEGA.44 109.84,35.75 109.86,35.74 109.86,35.05 108.81,34.01 108.81,30.86 v109.32,30.35
SR1  (via drill 0.33)
  Top 0.254: U$25.21 90.74,53.73 93.85,50.62 109.09,50.62 122.66,37.06 122.66,25.53 v122.43,25.3
  Bottom 0.254: v122.43,25.3 121.46,24.33 ATMEGA.74
SR2  (via drill 0.33)
  Top 0.254: U$26.21 53.91,49.31 57.35,45.87 67,45.87 69.14,43.74 85.14,43.74 87.63,41.25 95.3,41.25 95.56,41.5 99.31,41.5 105.21,35.61 105.21,34.16 107.52,31.85 v110.13,31.85
  Bottom 0.254: ATMEGA.47 111.34,33.06 v110.13,31.85
SR3  (via drill 0.33)
  Top 0.254: U$27.21 74.68,51.04 74.68,49.28 77.6,46.36 87.02,46.36 89.56,43.82 93.65,43.82 94.06,44.22 104.11,44.22 112.27,36.07 v112.27,35.33
  Bottom 0.254: ATMEGA.53 113.41,34.85 113.13,35.13 112.47,35.13 v112.27,35.33
SR4  (via drill 0.33)
  Top 0.254: v89.33,50.04 108.71,50.04 121.64,37.11 121.64,28.14 v121.31,27.81
  Bottom 0.254: U$28.21 88.85,49.56 v89.33,50.04 | v121.31,27.81 114.62,27.81 ATMEGA.67
SR5
  Bottom 0.254: U$29.21 87.87,32.47 93.24,27.1 93.24,20.52 93.8,19.96 101.35,19.96 102.36,20.98 102.36,22.08 ATMEGA.97
SR6
  Bottom 0.254: U$30.21 104.84,15.97 106.35,17.48 ATMEGA.89
TX0  (via drill 0.33)
  Top 0.254: JP4.RXI 71.38,2.66 | 71.38,2.66 R70.2 84.63,4.52 v87.55,4.52 | v96.34,24.82 95.58,24.05 95.58,9.19 v95.15,8.76 | U$1.1 15.01,23.31 15.01,15.29 11.96,12.24 v11.96,5.31 | v30,3.2 30.54,2.66 71.38,2.66
  Bottom 0.254: v95.15,8.76 90.91,4.52 v87.55,4.52 | v96.34,24.82 99.08,24.82 ATMEGA.3 | v30,3.2 13.95,3.2 11.96,5.18 v11.96,5.31
TX-CAN
  Bottom 0.406: CAN-TRANSCEIVER.3 22.51,11.05 CAN-CONTROLLER.1 30.66,4.89 TX-CAN.C
VBUS  (via drill 0.33)
  Top 0.254: v6.33,22.83 6.33,26.52 12.83,33.02 29.72,33.02 33.45,36.75 38.91,36.75 v39.17,36.5
  Bottom 0.254: CAN-TRANSCEIVER.8 6.82,13.81 5.92,14.71 5.92,22.43 v6.33,22.83 | v39.17,36.5 40.59,35.07 C55.2
  Bottom 0.305: R79.1 54.57,31.32 44.83,31.32 43.86,30.36 DC-DC.14
  Bottom 0.406: C55.2 40.59,30.36 DC-DC.14
VREC
  Bottom 0.305: DC-DC.12 49.42,27.82 50.67,29.06 52.46,29.06 DC-DC.16
  Bottom 0.406: C56.P$1 39.72,24.36 41.72,26.37 41.72,27.82 DC-DC.12
XTAL1
  Bottom 0.254: ATMEGA.34 104.84,38.95 108.79,42.9 108.79,42.93 109.41,43.55
  Bottom 0.406: 109.41,43.55 Q2.1 108.28,44.68 C40.1 R58.1
XTAL2
  Bottom 0.254: Q2.2 104.36,38.95 ATMEGA.33
  Bottom 0.406: R58.2 arc45 104.02,46.79 C41.1 101.78,44.83 Q2.2

## Text on the board
tPlace: DTR | TX0 | RX0 | PWR
bPlace: Reset | GND | 5V | SCL | SDA | GND | 5V | INT | RX-CAN | GND | GND | ESC | TX-CAN | Thruster Shield V1.0 | PWR | Designed by Shih Chiang